# Altium schematic sheet Blade-Side Schematic.SchDoc
size Legal
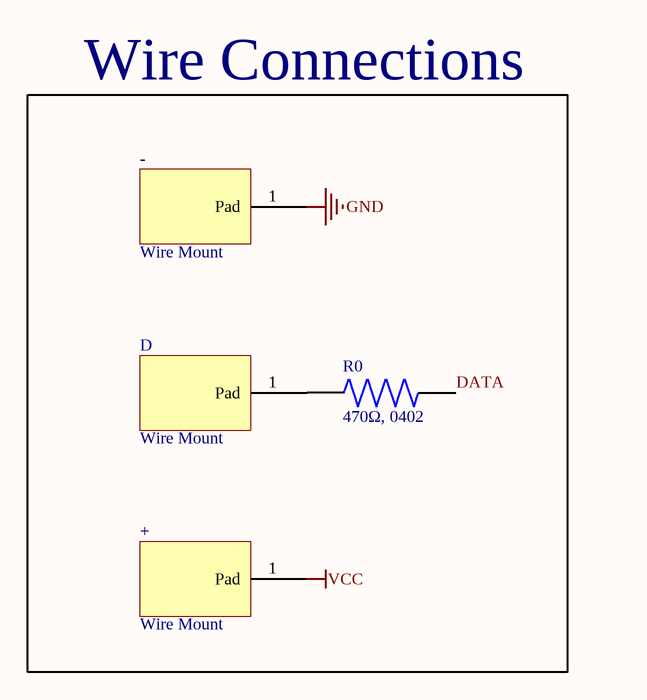
[diagram p0: Blade-Side Schematic.SchDoc]

## Parts
+  Wire Mount  [Wire Mount]
-  Wire Mount  [Wire Mount]
D  Wire Mount  [Wire Mount]
R0  470Ω, 0402  [0402]

## Blocks framed on the sheet
Wire Connections: + - D R0

## Nets
GND: -.1(Pad)
VCC: +.1(Pad)
DATA: R0.2
NetD_1: D.1(Pad) R0.1

## Library data of the parts
R0 = Resistor, 0402